# EAGLE design plc (EAGLE 8.1.0)
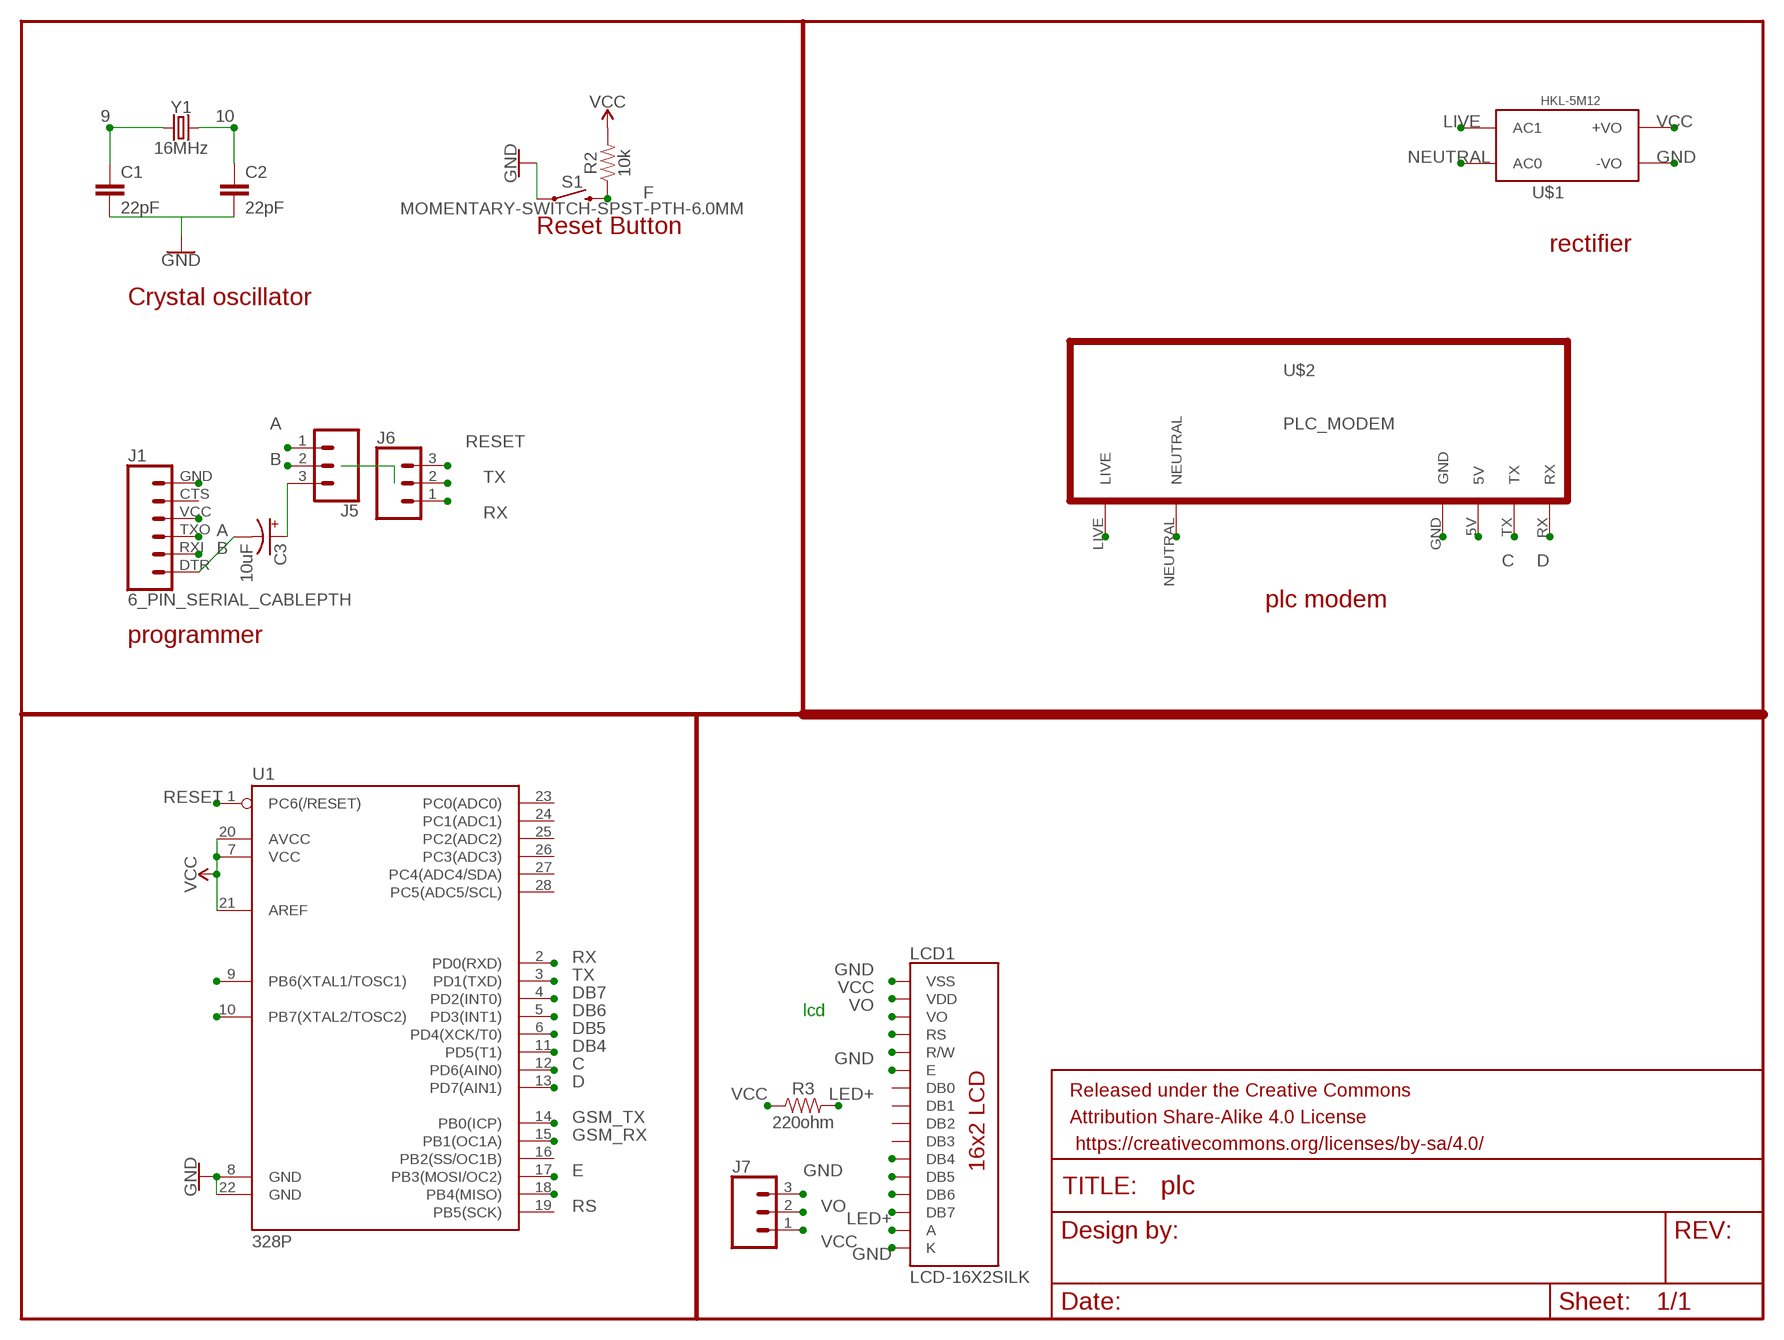
[diagram p0: schematic, sheet 1]

## Parts
C1  22pF  22PF-PTH-2.54MM-200V-5%  [CAP-PTH-2.54]
C2  22pF  22PF-PTH-2.54MM-200V-5%  [CAP-PTH-2.54]
C3  10uF  10UF-POLAR-RADIAL-2.5MM-25V-20%  [CPOL-RADIAL-2.5MM-5MM]
FRAME1  FRAME-LETTERNO_PACKAGE  [DUMMY]
J1  6_PIN_SERIAL_CABLEPTH  [FTDI_BASIC]
J5  CONN_03  [1X03]
J6  CONN_03  [1X03]
J7  CONN_03  [1X03]
LCD1  LCD-16X2SILK  [LCD-16X2]
R2  10k  10KOHM-HORIZ-1/4W-1%  [AXIAL-0.3]
R3  220ohm  1KOHM-HORIZ-1/4W-5%  [AXIAL-0.3]
S1  MOMENTARY-SWITCH-SPST-PTH-6.0MM  [TACTILE_SWITCH_PTH_6.0MM]
U1  328P  ATMEGA328P_PDIP  [DIP28]
U$1  HKL-5M12  [HLK-5M12]
U$2  PLC_MODEM  [PLC_SUNROM]
Y1  16MHz  CRYSTAL-16MHZPTH-HC49US  [HC49US]

## Nets
9: C1.1 U1.9(PB6(XTAL1/TOSC1)) Y1.1
10: C2.1 U1.10(PB7(XTAL2/TOSC2)) Y1.2
A: J1.TXO J5.1
B: J1.RXI J5.2
C: U1.12(PD6(AIN0)) U$2.TX
D: U1.13(PD7(AIN1)) U$2.RX
DB4: LCD1.11(DB4) U1.11(PD5(T1))
DB5: LCD1.12(DB5) U1.6(PD4(XCK/T0))
DB6: LCD1.13(DB6) U1.5(PD3(INT1))
DB7: LCD1.14(DB7) U1.4(PD2(INT0))
E: LCD1.6(E) U1.17(PB3(MOSI/OC2))
F: R2.P$1 S1.3
GND: C1.2 C2.2 J1.GND J7.3 LCD1.1(VSS) LCD1.5(R/W) LCD1.16(K) S1.1 U1.8(GND) U1.22(GND) U$1.3(-VO) U$2.GND
GSM_RX: U1.15(PB1(OC1A))
GSM_TX: U1.14(PB0(ICP))
LED+: LCD1.15(A) R3.P$2
LIVE: U$1.2(AC1) U$2.LIVE
N$1: C3.2(-) J1.DTR
N$4: C3.1(+) J5.3
NEUTRAL: U$1.1(AC0) U$2.NEUTRAL
RESET: J6.3 U1.1(PC6(/RESET))
RS: LCD1.4(RS) U1.18(PB4(MISO))
RX: J6.1 U1.2(PD0(RXD))
TX: J6.2 U1.3(PD1(TXD))
VCC: J1.VCC J7.1 LCD1.2(VDD) R2.P$2 R3.P$1 U1.7(VCC) U1.20(AVCC) U1.21(AREF) U$1.4(+VO) U$2.5V
VO: J7.2 LCD1.3(VO)
Unconnected: J1.CTS LCD1.7(DB0) LCD1.8(DB1) LCD1.9(DB2) LCD1.10(DB3) U1.16(PB2(SS/OC1B)) U1.19(PB5(SCK)) U1.23(PC0(ADC0)) U1.24(PC1(ADC1)) U1.25(PC2(ADC2)) U1.26(PC3(ADC3)) U1.27(PC4(ADC4/SDA)) U1.28(PC5(ADC5/SCL))

## Notes on the sheet
- Reset Button
- rectifier
- Crystal oscillator
- plc modem
- programmer
- lcd

## Library data of the parts
C1 C2 = SparkFun-Capacitors:22PF: 22pF ceramic capacitors A capacitor is a passive two-terminal electrical component used to store electrical energy temporarily in an electric field.; PROD_ID: CAP-09128
C3 = SparkFun-Capacitors:10UF-POLAR: 10.0µF polarized capacitors A capacitor is a passive two-terminal electrical component used to store electrical energy temporarily in an electric field.; PROD_ID: CAP-08440
FRAME1 = SparkFun-Aesthetics:FRAME-LETTER: Schematic Frame - Letter Standard 8.5x11 US Letter frame; DESIGNER: Nobody; VERSION: v01
J1 = SparkFun-Connectors:6_PIN_SERIAL_CABLE: 6-pin header connection for use with the "FTDI BASIC" pinout - CABLE SIDE. Also known as "Arduino Serial Program Header". This is used on a design to provide a 6-pin connection point for serial communication usually from a USB cable (D+/D-) to these headers (RX/TX). It also has the remaining pins necessary for programming in the Arduino evironment (DTR, GND, and sometimes VCC). Note, this device has "CABLE" in the name. It is intended to be used on a design that usually lives on the end of your USB cable and prvides the converter chip (FTDI232 or FTDI231x) to commnicate serial RX/TX. The "sister" device, named "TARGET" is inteneded to be used on a design that contains a target micro-controller that you wish to program. You can populate with some of these: Female Headers <https://www.sparkfun.com/products/115> (PRT-00115) For reference (or to suit your programming needs) check out these designs: SparkFun FTDI Basic Breakout - 5V <https://www.sparkfun.com/products/9716> (DEV-09716) SparkFun FTDI Basic Breakout - 3.3V <https://www.sparkfun.com/products/9873> (DEV-09873) SparkFun FTDI SmartBasic <https://www.sparkfun.com/products/12935> (DEV-12935) SparkFun Beefy 3 - FTDI Basic Breakout <https://www.sparkfun.com/products/13746> (DEV-13746)
J5-J7 = SparkFun-Connectors:CONN_03: Multi connection point. Often used as Generic Header-pin footprint for 0.1 inch spaced/style header connections On any of the 0.1 inch spaced packages, you can populate with these: Break Away Headers - Straight <https://www.sparkfun.com/products/116> (PRT-00116) Break Away Male Headers - Right Angle <https://www.sparkfun.com/products/553> (PRT-00553) Female Headers <https://www.sparkfun.com/products/115> (PRT-00115) Break Away Headers - Machine Pin <https://www.sparkfun.com/products/117> (PRT-00117) Break Away Female Headers - Swiss Machine Pin <https://www.sparkfun.com/products/743> (PRT-00743) Stackable Header - 3 Pin (Female, 0.1") <https://www.sparkfun.com/products/13875> (PRT-13875) For SCREWTERMINALS and SPRING TERMINALS visit here: Screw Terimnals on SparkFun.com <https://www.sparkfun.com/search/results?term=Screw+Terminals> (5mm/3.5mm/2.54mm spacing) This device is also useful as a general connection point to wire up your design to another part of your project. Our various solder wires solder well into these plated through hole pads. Hook-Up Wire - Assortment (Stranded, 22 AWG) <https://www.sparkfun.com/products/11375> (PRT-11375) Hook-Up Wire - Assortment (Solid Core, 22 AWG) <https://www.sparkfun.com/products/11367> (PRT-11367) View the entire wire category on our website here <https://www.sparkfun.com/categories/141> Special notes: Molex polarized connector foot print use with SKU : PRT-08232 with associated crimp pins and housings.
LCD1 = SparkFun-Displays:LCD-16X2: Standard text-only 16x2 parallel input LCD Basic 16 character by 2 line display. Typically utilizes the extremely common HD44780 parallel interface chipset SparkFun Products: Basic 16x2 Green <https://www.sparkfun.com/products/255> Basic 8x2 Green <https://www.sparkfun.com/products/11122>; SF_ID: LCD-00255
R2 = SparkFun-Resistors:10KOHM: 10kΩ resistor A resistor is a passive two-terminal electrical component that implements electrical resistance as a circuit element. Resistors act to reduce current flow, and, at the same time, act to lower voltage levels within circuits. - Wikipedia; PROD_ID: RES-12183
R3 = SparkFun-Resistors:1KOHM: 1kΩ resistor A resistor is a passive two-terminal electrical component that implements electrical resistance as a circuit element. Resistors act to reduce current flow, and, at the same time, act to lower voltage levels within circuits. - Wikipedia; PROD_ID: RES-08380; VALUE: 1k
S1 = SparkFun-Switches:MOMENTARY-SWITCH-SPST: Momentary Switch (Pushbutton) - SPST Normally-open (NO) SPST momentary switches (buttons, pushbuttons). Variants PTH-12MM - 12mm square, through-hole Momentary Pushbutton Switch - 12mm Square <https://www.sparkfun.com/products/9190> (COM-09190) PTH-6.0MM, PTH-6.0MM-KIT - 6.0mm square, through-hole Mini Pushbutton Switch <https://www.sparkfun.com/products/97> (COM-00097) KIT package intended for soldering kit's - only one side of pads' copper is exposed. PTH-RIGHT-ANGLE-KIT - Right-angle, through-hole Right Angle Tactile Button <https://www.sparkfun.com/products/10791> - Used on SparkFun BigTime Watch Kit <https://www.sparkfun.com/products/11734> SMD-12MM - 12mm square, surface-mount Tactile Button - SMD (12mm) <https://www.sparkfun.com/products/12993> (COM-12993) Used on SparkFun PicoBoard <https://www.sparkfun.com/products/11888> SMD-4.5MM - 4.5mm Square Trackball Switch Used on SparkFun Blackberry Trackballer Breakout <https://www.sparkfun.com/products/13169> SMD-4.6MMX2.8MM - 4.60mm x 2.80mm, surface mount Used on SparkFun SAMD21 Mini Breakout <https://www.sparkfun.com/products/13664> SMD-5.2MM, SMD-5.2-REDUNDANT - 5.2mm square, surface-mount Mini Pushbutton Switch - SMD <https://www.sparkfun.com/products/8720> (COM-08720) Used on Arduino Pro Mini <https://www.sparkfun.com/products/11114> REDUNDANT package connects both switch circuits together SMD-6.0X3.5MM - 6.0 x 3.5mm, surface mount Momentary Reset Switch SMD <https://www.sparkfun.com/products/8229> (COM-08229) SMD-6.2MM-TALL - 6.2mm square, surface mount Tactile Button - SMD (6mm) <https://www.sparkfun.com/products/12992> Used on SparkFun Digital Sandbox <https://www.sparkfun.com/products/12651> SMD-RIGHT-ANGLE - Right-angle, surface mount Used on SparkFun Block for Intel® Edison - Arduino <https://www.sparkfun.com/products/13036>; PROD_ID: SWCH-08441; SF_SKU: COM-00097
U1 = SparkFun-IC-Microcontroller:ATMEGA328P_PDIP: Atmel 328P Through hole ATMEGA328P uC used in the Arduino 32kb flash, 1k EEPROM, 2k SRAM Datasheet <http://www.sparkfun.com/datasheets/Components/SMD/ATMega328.pdf> SparkFun Products Storefront component: AVR 28 Pin 20MHz 32K 6A/D - ATMega328P <https://www.sparkfun.com/products/9061> (COM-09061) SparkFun Simon Says - Through-Hole Soldering Kit <https://www.sparkfun.com/products/10547> (KIT-10547) SparkFun Learn to Solder - Simon Says <https://www.sparkfun.com/products/13708> (KIT-13708) SparkFun BigTime Watch Kit <https://www.sparkfun.com/products/11734> (KIT-11734) SparkFun ClockIt <https://www.sparkfun.com/products/10930> (KIT-10930) SparkFun Serial Enabled LCD Kit <https://www.sparkfun.com/products/10097> (LCD-10097) SparkFun Simon Tilts - Through Hole Soldering Kit <https://www.sparkfun.com/products/12634> (KIT-12634) SparkFun Frequency Counter Kit <https://www.sparkfun.com/products/10140> (KIT-10140) FabFM Radio Kit <https://www.sparkfun.com/products/11043> (KIT-11043) SparkFun Binary Blaster Kit <https://www.sparkfun.com/products/12037> (KIT-12037) SparkFun Metro-Gnome <https://www.sparkfun.com/products/9236> (KIT-09236) ATmega328 with Arduino Optiboot (Uno) <https://www.sparkfun.com/products/10524> (DEV-10524); PROD_ID: IC-09136
U$1 = hilink:HKL-5M12
U$2 = plc_modem:PLC_MODEM
Y1 = SparkFun-Clocks:CRYSTAL-16MHZ: 16MHz Crystal Digikey Example <http://www.digikey.com/product-search/en?keywords=535-9122-1-ND> Frequency: 16MHz Frequency Stability: ±50ppm Frequency Tolerance: ±20ppm Load Capacitance: 18pF SparkFun Products: Pro Micro -5V/16MHz <https://www.sparkfun.com/products/12640> SparkFun Serial Enabled LCD Kit <https://www.sparkfun.com/products/10097>; PROD_ID: XTAL-08181; SF_ID: COM-00536

## Board
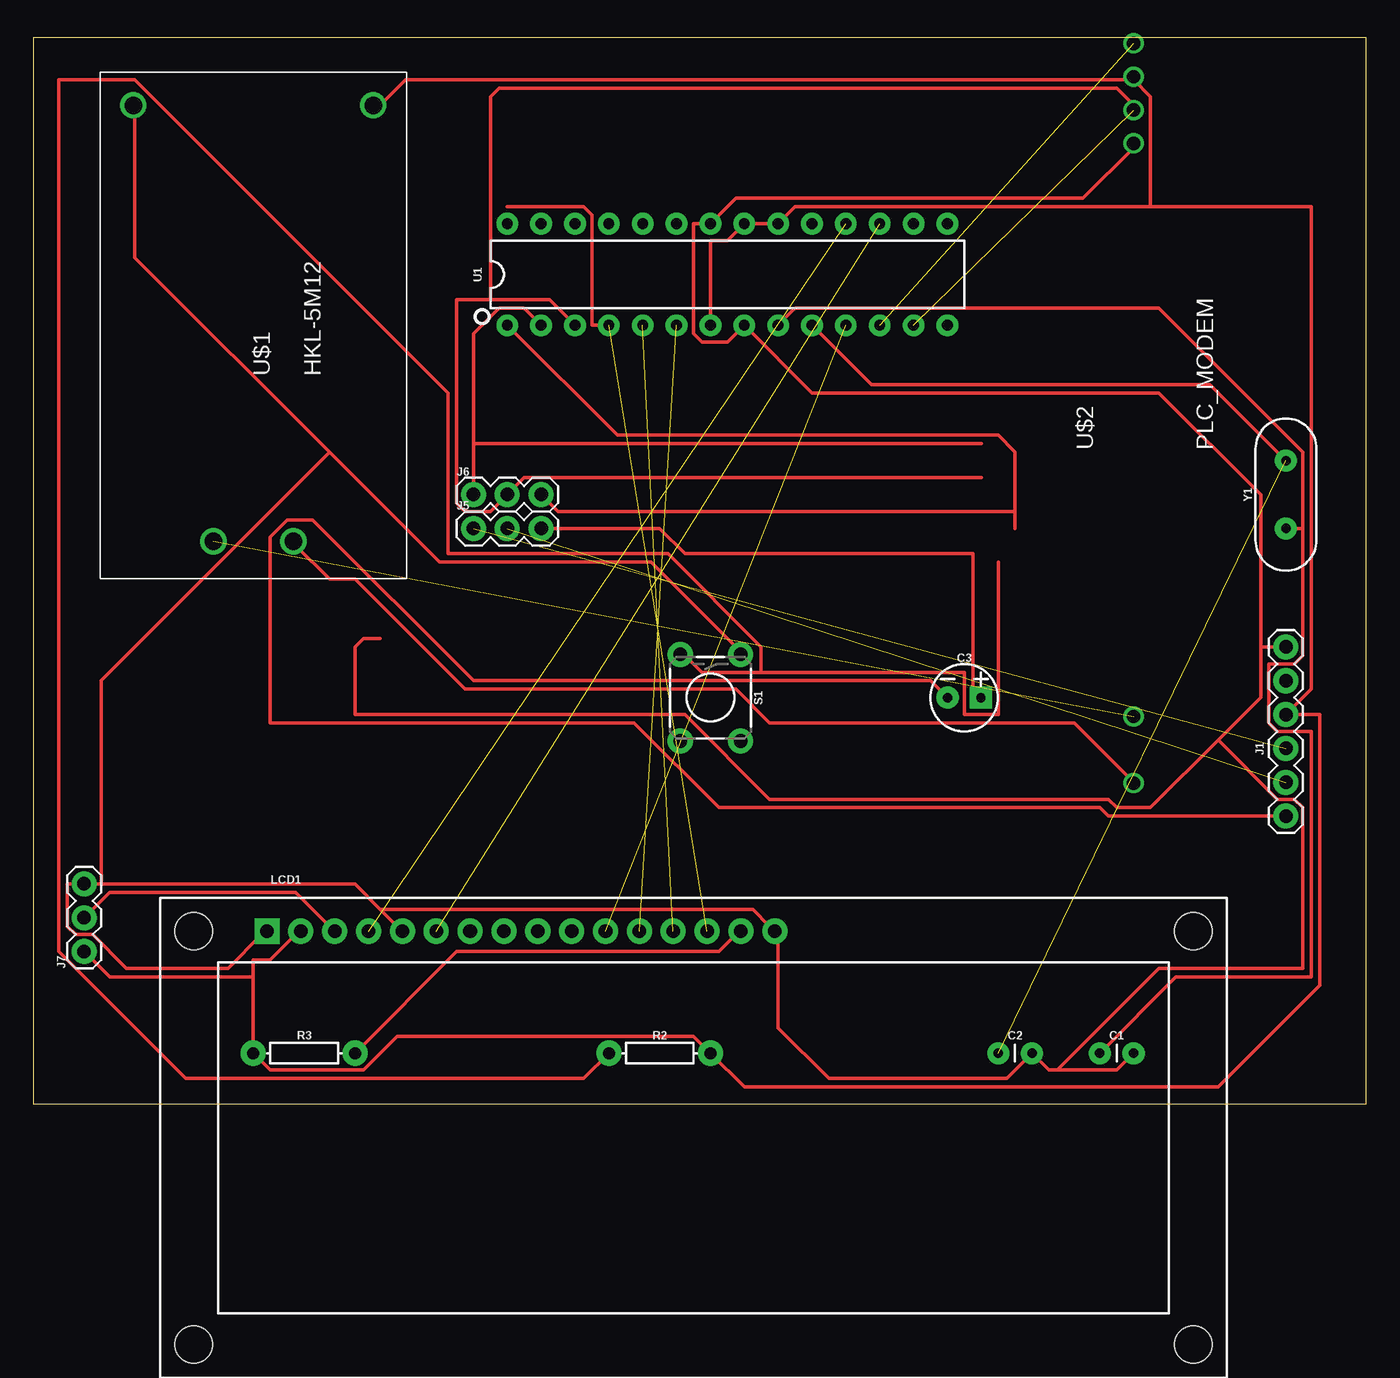
[diagram p1: board, top side]

Size 100 x 80 mm. Coordinates in mm from the lower left corner, seen from the top.
Outline: 0,0 100,0 100,80 0,80 0,0
Copper layers (1*16): Top 0.035mm / dielectric 1.5mm / Bottom 0.035mm
Design rules "default": minimum track width 10mil, minimum drill 24mil, track to track 8mil, track to pad 8mil, pad to pad 8mil, via to via 8mil, smd to smd 8mil, copper to edge 40mil, drill to drill 8mil, minimum pad ring 10mil, minimum via ring 8mil, stop-mask expansion 4mil, vias tented up to drill 0mil, thermal gap 10mil

### Footprints (pad centres in the part's own frame; a part is rotated, then mirrored left to right if it is on the bottom)
CAP-PTH-2.54 = drill 0.7 pad 1.651: 1 -1.27,0; 2 1.27,0
CPOL-RADIAL-2.5MM-5MM = drill 0.7 pad 1.651 square: 1 1.25,0 | drill 0.7 pad 1.651: 2 -1.25,0
FTDI_BASIC = drill 1.016 pad 1.88: CTS 10.16,0; DTR 0,0; GND 12.7,0; RXI 2.54,0; TXO 5.08,0; VCC 7.62,0
1X03 = drill 1.016 pad 1.88: 1 0,0; 2 2.54,0; 3 5.08,0
LCD-16X2 = drill 1.016 pad 1.88 square: 1 -32,15.5 | drill 1.016 pad 1.88: 2 -29.46,15.5; 3 -26.92,15.5; 4 -24.38,15.5; 5 -21.84,15.5; 6 -19.3,15.5; 7 -16.76,15.5; 8 -14.22,15.5; 9 -11.68,15.5; 10 -9.14,15.5; 11 -6.6,15.5; 12 -4.06,15.5; 13 -1.52,15.5; 14 1.02,15.5; 15 3.56,15.5; 16 6.1,15.5 | hole 2.8: -37.5,15.5; -37.5,-15.5; 37.5,15.5; 37.5,-15.5
AXIAL-0.3 = drill 0.9 pad 1.88: P$1 -3.81,0; P$2 3.81,0
TACTILE_SWITCH_PTH_6.0MM = drill 1.016 pad 1.88: 1 -3.251,2.261; 2 3.251,2.261; 3 -3.251,-2.261; 4 3.251,-2.261
DIP28 = drill 0.813 pad 1.626: 1 -16.51,-3.81; 2 -13.97,-3.81; 3 -11.43,-3.81; 4 -8.89,-3.81; 5 -6.35,-3.81; 6 -3.81,-3.81; 7 -1.27,-3.81; 8 1.27,-3.81; 9 3.81,-3.81; 10 6.35,-3.81; 11 8.89,-3.81; 12 11.43,-3.81; 13 13.97,-3.81; 14 16.51,-3.81; 15 16.51,3.81; 16 13.97,3.81; 17 11.43,3.81; 18 8.89,3.81; 19 6.35,3.81; 20 3.81,3.81; 21 1.27,3.81; 22 -1.27,3.81; 23 -3.81,3.81; 24 -6.35,3.81; 25 -8.89,3.81; 26 -11.43,3.81; 27 -13.97,3.81; 28 -16.51,3.81
HLK-5M12 = drill 1.3 pad 2: 1 -16.2,3; 2 -16.2,-3 | drill 1.3 pad 1.676: 3 16.5,9; 4 16.5,-9
PLC_SUNROM = drill 1 pad 1.422: 5V 25,0; GND 20,0; LIVE -28,0; NEUTRAL -23,0; RX 22.5,0; TX 27.5,0
HC49US = drill 0.7 pad 1.651: 1 -2.54,0; 2 2.54,0

### Placement (x,y rotation side)
C1  81.28,3.81 0 top
C2  73.66,3.81 0 top
C3  69.85,30.48 0 top
FRAME1  -63.5,60.96 0 top  (outside the outline)
J1  93.98,21.59 90 top
J5  33.02,43.18 0 top
J6  33.02,45.72 0 top
J7  3.81,11.43 90 top
LCD1  49.53,-2.54 0 top
R2  46.99,3.81 0 top
R3  20.32,3.81 0 top
S1  50.8,30.48 270 top
U1  52.07,62.23 0 top
U$1  16.51,58.42 90 top
U$2  82.55,52.07 90 top
Y1  93.98,45.72 90 top

### Tracks (layer width: path | path; a pad name or v marks a point on that pad's centre or on a via)
9
  Top 0.254: U1.9 57.15,59.69 84.45,59.69 95.25,48.9 95.25,43.18 | Y1.1 95.25,43.18 | C1.1 85.72,9.53 95.89,9.53 95.89,27.94 93.34,27.94 92.71,28.57 92.71,33.02 94.61,33.02 95.25,33.66 95.25,43.18
10  (1 unrouted)
  Top 0.254: U1.10 62.87,53.98 88.27,53.98 Y1.2
A  (1 unrouted)
B  (1 unrouted)
C  (1 unrouted)
D  (1 unrouted)
DB4  (1 unrouted)
DB5  (1 unrouted)
DB6  (1 unrouted)
DB7  (1 unrouted)
  Top 0.254: 35.56,67.31 41.27,67.31 41.91,66.67 41.91,58.42 U1.4
E  (1 unrouted)
F
  Top 0.254: R2.P$1 41.27,1.91 11.43,1.91 1.91,11.43 1.91,76.83 7.62,76.83 31.11,53.34 31.11,41.27 47.62,41.27 54.61,34.29 54.61,32.38 | 54.61,32.38 50.16,32.38 48.9,33.66 S1.3 | 72.39,40.64 72.39,29.21 69.85,29.21 69.85,32.38 54.61,32.38
GND
  Top 0.254: U$2.GND 82.55,71.75 78.74,67.94 52.7,67.94 U1.22 49.53,66.04 49.53,57.78 50.16,57.15 52.07,57.15 U1.8 58.42,53.34 84.45,53.34 92.08,45.72 92.08,34.29 | 26.04,34.92 24.77,34.92 24.13,34.29 24.13,29.21 48.9,29.21 55.24,22.86 80.64,22.86 81.28,22.23 83.82,22.23 88.9,27.3 | 88.9,27.3 92.08,30.48 92.08,34.29 | J1.GND 92.08,34.29 | 22.23,48.9 7.62,63.5 7.62,74.3 U$1.3 | 22.23,48.9 30.48,40.64 46.35,40.64 52.7,34.29 S1.1 | 76.83,2.54 81.28,2.54 C1.2 | 76.83,2.54 76.2,2.54 C2.2 73.03,1.91 59.69,1.91 55.88,5.71 55.88,12.7 LCD1.16 55.24,13.34 53.98,14.61 26.04,14.61 | LCD1.1 17.14,12.7 14.61,10.16 6.99,10.16 4.45,12.7 3.17,12.7 2.54,13.34 2.54,16.51 J7.3 5.08,16.51 | 26.04,14.61 24.13,16.51 5.08,16.51 | 26.04,14.61 27.3,13.34 LCD1.5 | 22.23,48.9 5.08,31.75 5.08,16.51 | 88.9,27.3 93.34,22.86 94.61,22.86 95.25,22.23 95.25,10.16 84.45,10.16 76.83,2.54
LED+
  Top 0.254: R3.P$2 31.75,11.43 51.44,11.43 52.7,12.7 LCD1.15
LIVE
  Top 0.254: U$2.LIVE 82.55,24.13 78.11,28.57 55.24,28.57 52.7,31.11 32.38,31.11 24.13,39.37 22.23,39.37 19.68,41.91 U$1.2
N$1
  Top 0.254: J1.DTR 80.64,21.59 80.01,22.23 51.44,22.23 45.09,28.57 17.78,28.57 17.78,42.55 19.05,43.81 20.95,43.81 33.02,31.75 67.31,31.75 68.58,30.48 C3.2
N$4
  Top 0.254: J5.3 46.99,43.18 48.9,41.27 70.48,41.27 70.48,30.48 C3.1
NEUTRAL  (1 unrouted)
RESET
  Top 0.254: U1.1 43.81,50.16 72.39,50.16 73.66,48.9 73.66,44.45 | 73.66,43.18 73.66,44.45 | J6.3 39.37,44.45 73.66,44.45
RS  (1 unrouted)
RX
  Top 0.254: U1.2 36.83,59.69 34.92,59.69 33.02,57.78 33.02,49.53 | J6.1 33.02,49.53 | 33.02,49.53 71.12,49.53
TX
  Top 0.254: 82.55,74.93 81.28,76.2 34.92,76.2 34.29,75.56 34.29,60.33 | 34.29,60.33 38.73,60.33 U1.3 | 34.29,60.33 31.75,60.33 31.75,45.09 32.38,44.45 34.29,44.45 J6.2 36.83,46.99 71.12,46.99
VCC
  Top 0.254: 16.51,9.53 16.51,10.79 17.78,10.79 19.68,12.7 LCD1.2 | 16.51,9.53 R3.P$1 17.78,2.54 24.77,2.54 27.3,5.08 49.53,5.08 R2.P$2 53.34,1.27 88.9,1.27 96.52,8.89 96.52,29.21 J1.VCC 95.89,31.11 95.89,67.31 83.82,67.31 | J7.1 5.71,9.53 16.51,9.53 | U1.7 50.8,64.77 52.07,64.77 U1.21 U1.20 57.15,67.31 83.82,67.31 | 82.55,76.83 83.82,75.56 83.82,67.31 | 82.55,76.83 27.94,76.83 26.04,74.93 U$1.4 | 82.55,76.83 U$2.5V
VO
  Top 0.254: J7.2 5.71,15.88 19.68,15.88 22.23,13.34 LCD1.3